# Altium project Tray 3.PrjPcb
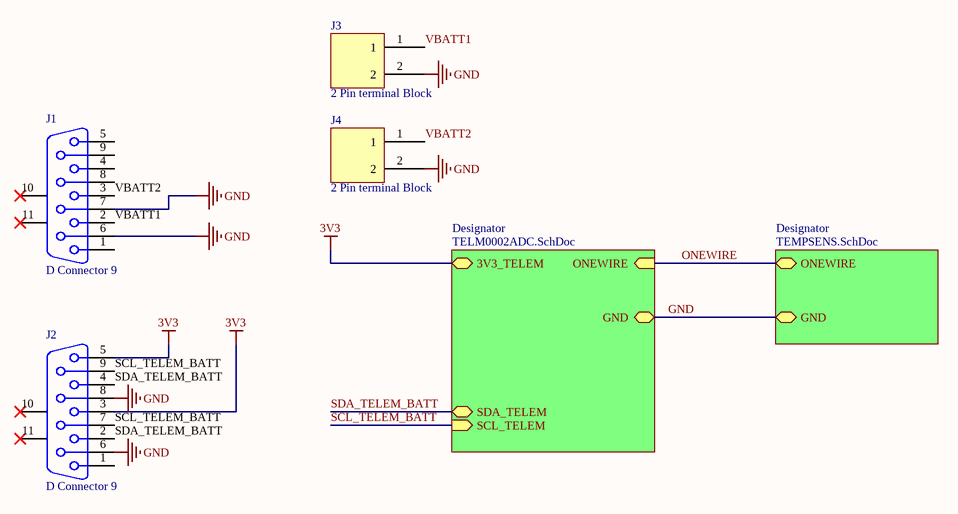
[diagram p0: Tray3.SchDoc]
3 sheets, 15 parts. Net scope: hierarchical (ports join the sheet entries above them; power ports are global).
Board file: Tray3.PcbDoc
Sheets:
  Tray3.SchDoc
    Designator = TELM0002ADC.SchDoc
    Designator = TEMPSENS.SchDoc

## Sheet Tray3.SchDoc
size A4

### Parts
J1  D Connector 9  [DSUB Upright]
J2  D Connector 9  [DSUB Upright]
J3  2 Pin terminal Block  [5.05mm Terminal Block - 2]
J4  2 Pin terminal Block  [5.05mm Terminal Block - 2]

### Sub-sheets
Designator = TELM0002ADC.SchDoc: 3V3_TELEM, SDA_TELEM (bidir), ONEWIRE (in), GND, SCL_TELEM (in)
Designator = TEMPSENS.SchDoc: ONEWIRE (bidir), GND

### Nets
3V3: J2.3 J2.5 ; sheet Designator/3V3_TELEM
GND: J1.6 J1.7 J2.6 J2.8 J3.2 J4.2 ; sheet Designator/GND, sheet Designator/GND
ONEWIRE: sheet Designator/ONEWIRE, sheet Designator/ONEWIRE
SCL_TELEM_BATT: J2.7 J2.9 ; sheet Designator/SCL_TELEM
SDA_TELEM_BATT: J2.2 J2.4 ; sheet Designator/SDA_TELEM
VBATT1: J1.2 J3.1
VBATT2: J1.3 J4.1

Not connected (* = marked no-connect by the designer): J1 1 4 5 8 9 10(MH1)* 11(MH2)*; J2 1 10(MH1)* 11(MH2)*

### Library data of the parts
J1 J2 = D Connector 9: Receptacle Assembly, 9 Position, Right Angle; Supplier: Digikey
J3 J4 = 2 Terminal Block: Terminal Block, 5.08mm; Supplier: Digikey

## Sheet TELM0002ADC.SchDoc: MAX127 Telemetry Circuit
size A3; Engineer: A. SHAW; Organization: BLUEsat Project; Address1: Room 419; Address2: School of EE&T; Address3: UNSW, NSW 2052; Address4: Australia; DocumentNumber: TELM0002; SheetNumber: 1; SheetTotal: 1; Description: Telemetry ADC Circuit; Version: 1.0
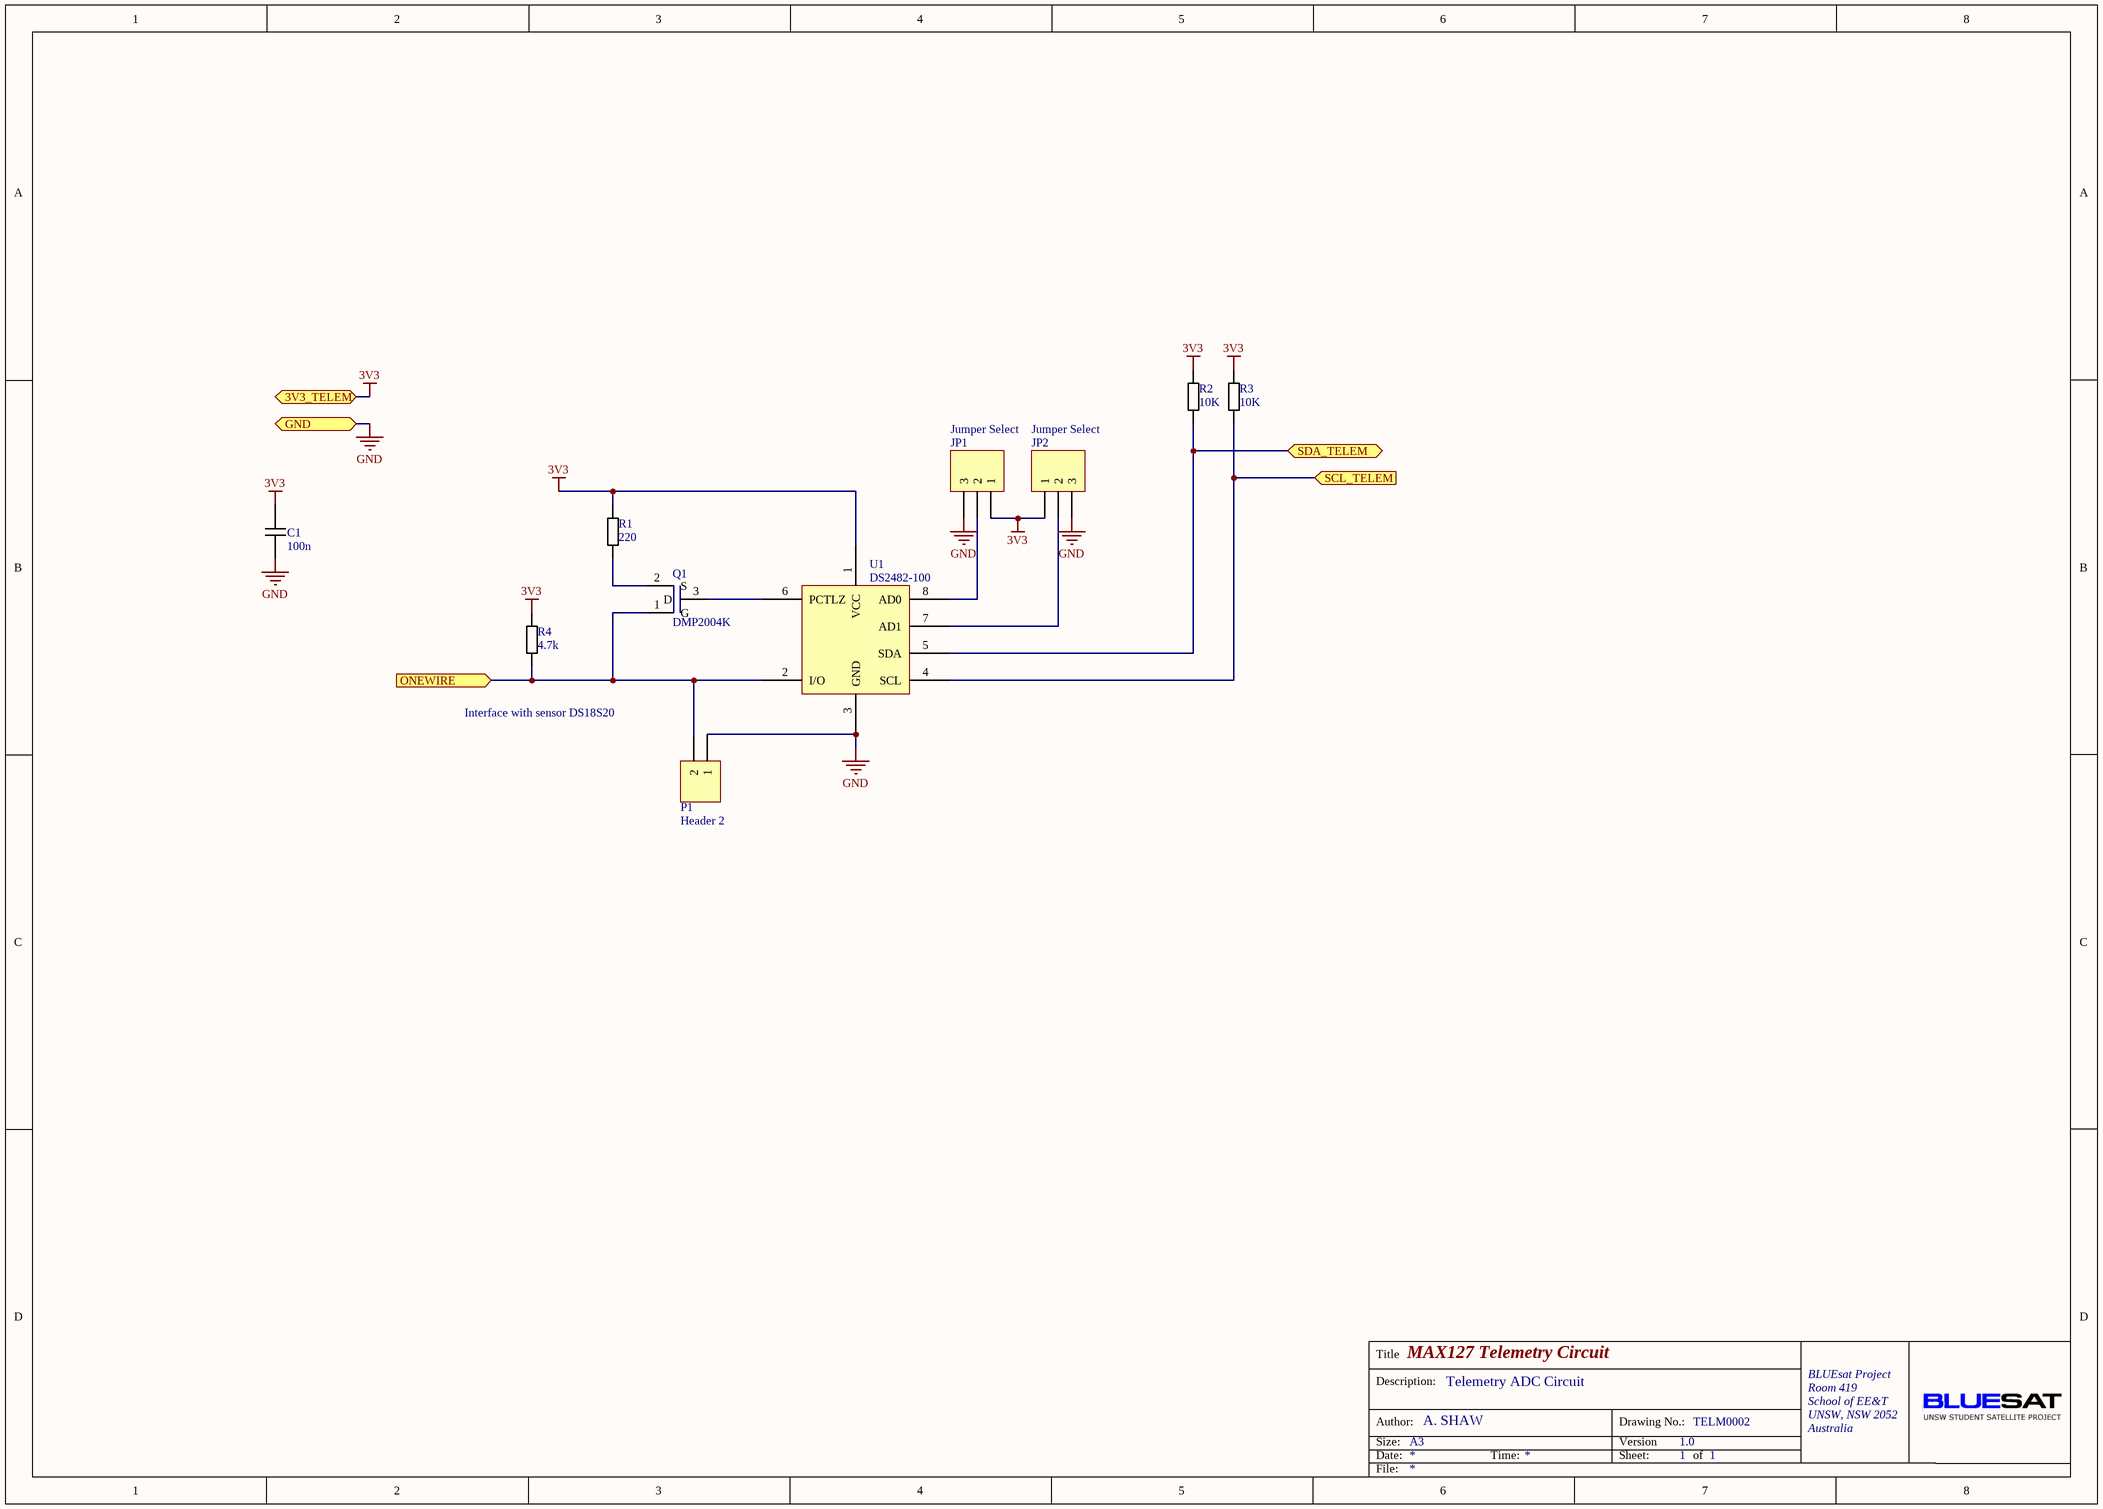
[diagram p1: TELM0002ADC.SchDoc]

### Parts
C1  value 100n  [0805 Cap]  (hidden comment: 0805 Cap)
JP1  Jumper Select  [SOLDER_JUMPER_3_A]  (no BOM)
JP2  Jumper Select  [SOLDER_JUMPER_3_A]  (no BOM)
P1  Header 2  [HDR1X2]
Q1  DMP2004K  [DMP2004KDITR-ND]
R1  value 220  [0805 Resistor]  (hidden comment: 0805 Resistor)
R2  value 10K  [0805 Resistor]  (hidden comment: 0805 Resistor)
R3  value 10K  [0805 Resistor]  (hidden comment: 0805 Resistor)
R4  value 4.7k  [0805 Resistor]  (hidden comment: 0805 Resistor)
U1  DS2482-100  [DS2482-100]

### Ports
3V3_TELEM, GND, ONEWIRE (in), SCL_TELEM (in), SDA_TELEM (bidir)

### Nets
3V3: C1.2 JP1.1 JP2.1 R1.2 R2.2 R3.2 R4.2 U1.1(VCC) ; port 3V3_TELEM
GND: C1.1 JP1.3 JP2.3 P1.1 U1.3(GND) ; port GND
ONEWIRE: P1.2 Q1.1(G) R4.1 U1.2(I/O) ; port ONEWIRE
SCL_TELEM_BATT: R3.1 U1.4(SCL) ; port SCL_TELEM
SDA_TELEM_BATT: R2.1 U1.5(SDA) ; port SDA_TELEM
NetJP1_2: JP1.2 U1.8(AD0)
NetJP2_2: JP2.2 U1.7(AD1)
NetQ1_2: Q1.2(S) R1.1
NetQ1_3: Q1.3(D) U1.6(PCTLZ)

### Notes on the sheet
- Interface with sensor DS18S20
- Title
- Description:
- Size:
- Author:
- Date:
- A3
- Time:
- Version
- Sheet:
- Drawing No.:
- of
- File:

### Library data of the parts
C1 = 0805 MLCC - X7R, 10%: Manufacturer: Kit; Manufacturer P/N: Kit; Supplier: Digikey
JP1 JP2 = Header 3: Header, 3-Pin
P1 = Header 2: Header, 2-Pin; Supplier: Digikey
Q1 = DMP2004K: MOSFET P-CH 20V 600MA SOT23-3; Manufacturer: Diodes Inc.; Manufacturer P/N: DMP2004K; Supplier: Digikey; Supplier P/N: DMP2004KDICT-ND
R1-R4 = 0805 Thick Film Resistor 1%: Manufacturer: Kit; Manufacturer P/N: Kit; Supplier: Digikey
U1 = DS2482-100: I2C to 1-Wire Master; Manufacturer: Maxim; Manufacturer P/N: DS2482S+; Supplier: Digikey; Supplier P/N: DS2482S-100+T&RCT-ND

## Sheet TEMPSENS.SchDoc
size A4
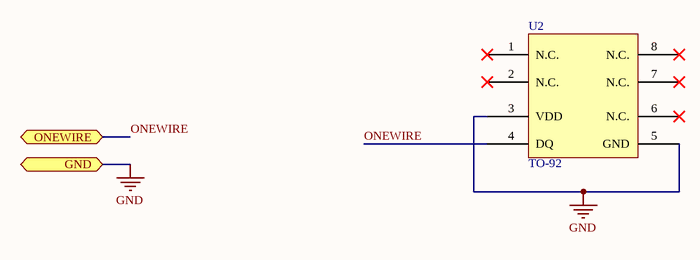
[diagram p2: TEMPSENS.SchDoc]

### Parts
U2  TO-92  [DS18S20]

### Ports
GND, ONEWIRE (bidir)

### Nets
GND: U2.3(VDD) U2.5(GND) ; port GND
ONEWIRE: U2.4(DQ) ; port ONEWIRE

Not connected (* = marked no-connect by the designer): U2 1(N.C.)* 2(N.C.)* 6(N.C.)* 7(N.C.)* 8(N.C.)*

### Library data of the parts
U2 = DS18S20: 1-Wire Digital Thermometer; Manufacturer: Maxim; Manufacturer P/N: DS18S20+; Supplier: Digikey; Supplier P/N: DS18S20Z+T&RCT-ND

## Nets that join several sheets
3V3: Tray3 (J2.3 J2.5), TELM0002ADC (8 pins)
GND: Tray3 (6 pins), TELM0002ADC (5 pins), TEMPSENS (U2.3 U2.5)
ONEWIRE: TELM0002ADC (P1.2 Q1.1 R4.1 U1.2), TEMPSENS (U2.4)
SCL_TELEM_BATT: Tray3 (J2.7 J2.9), TELM0002ADC (R3.1 U1.4)
SDA_TELEM_BATT: Tray3 (J2.2 J2.4), TELM0002ADC (R2.1 U1.5)